# EAGLE board radio_module (EAGLE 6.6.0)
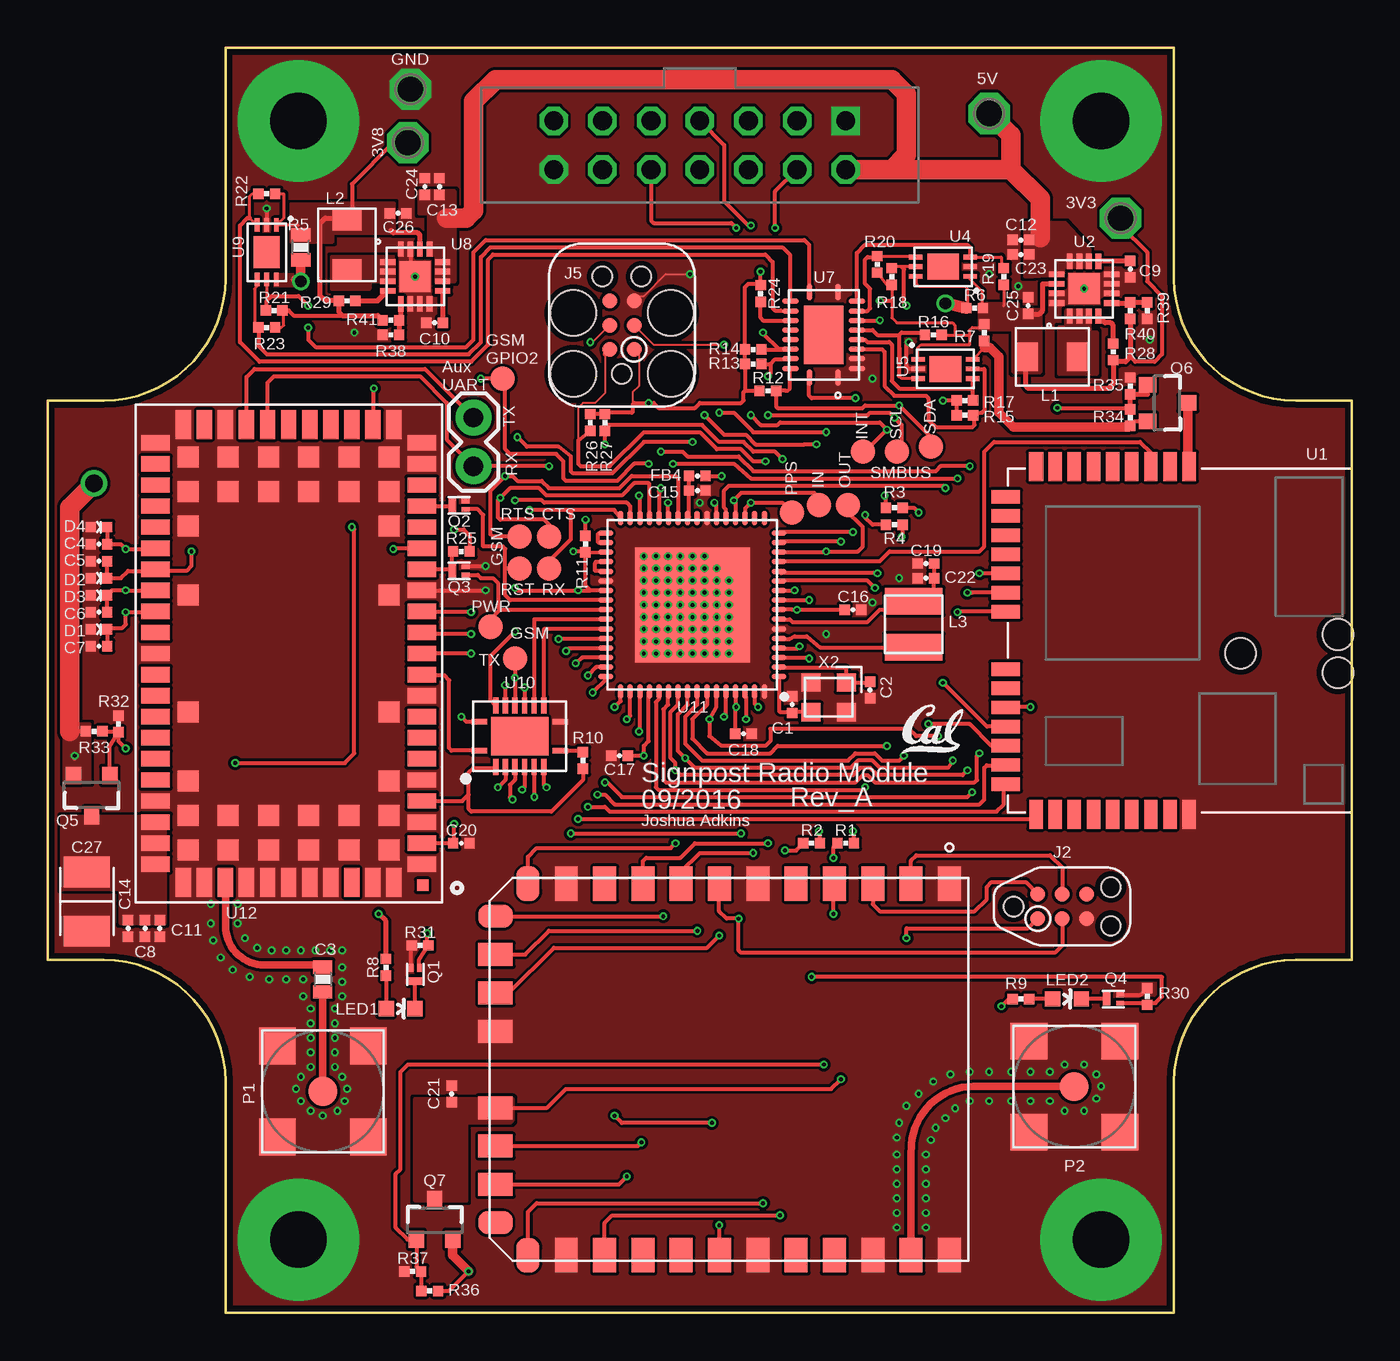
[diagram p5: board, top side]
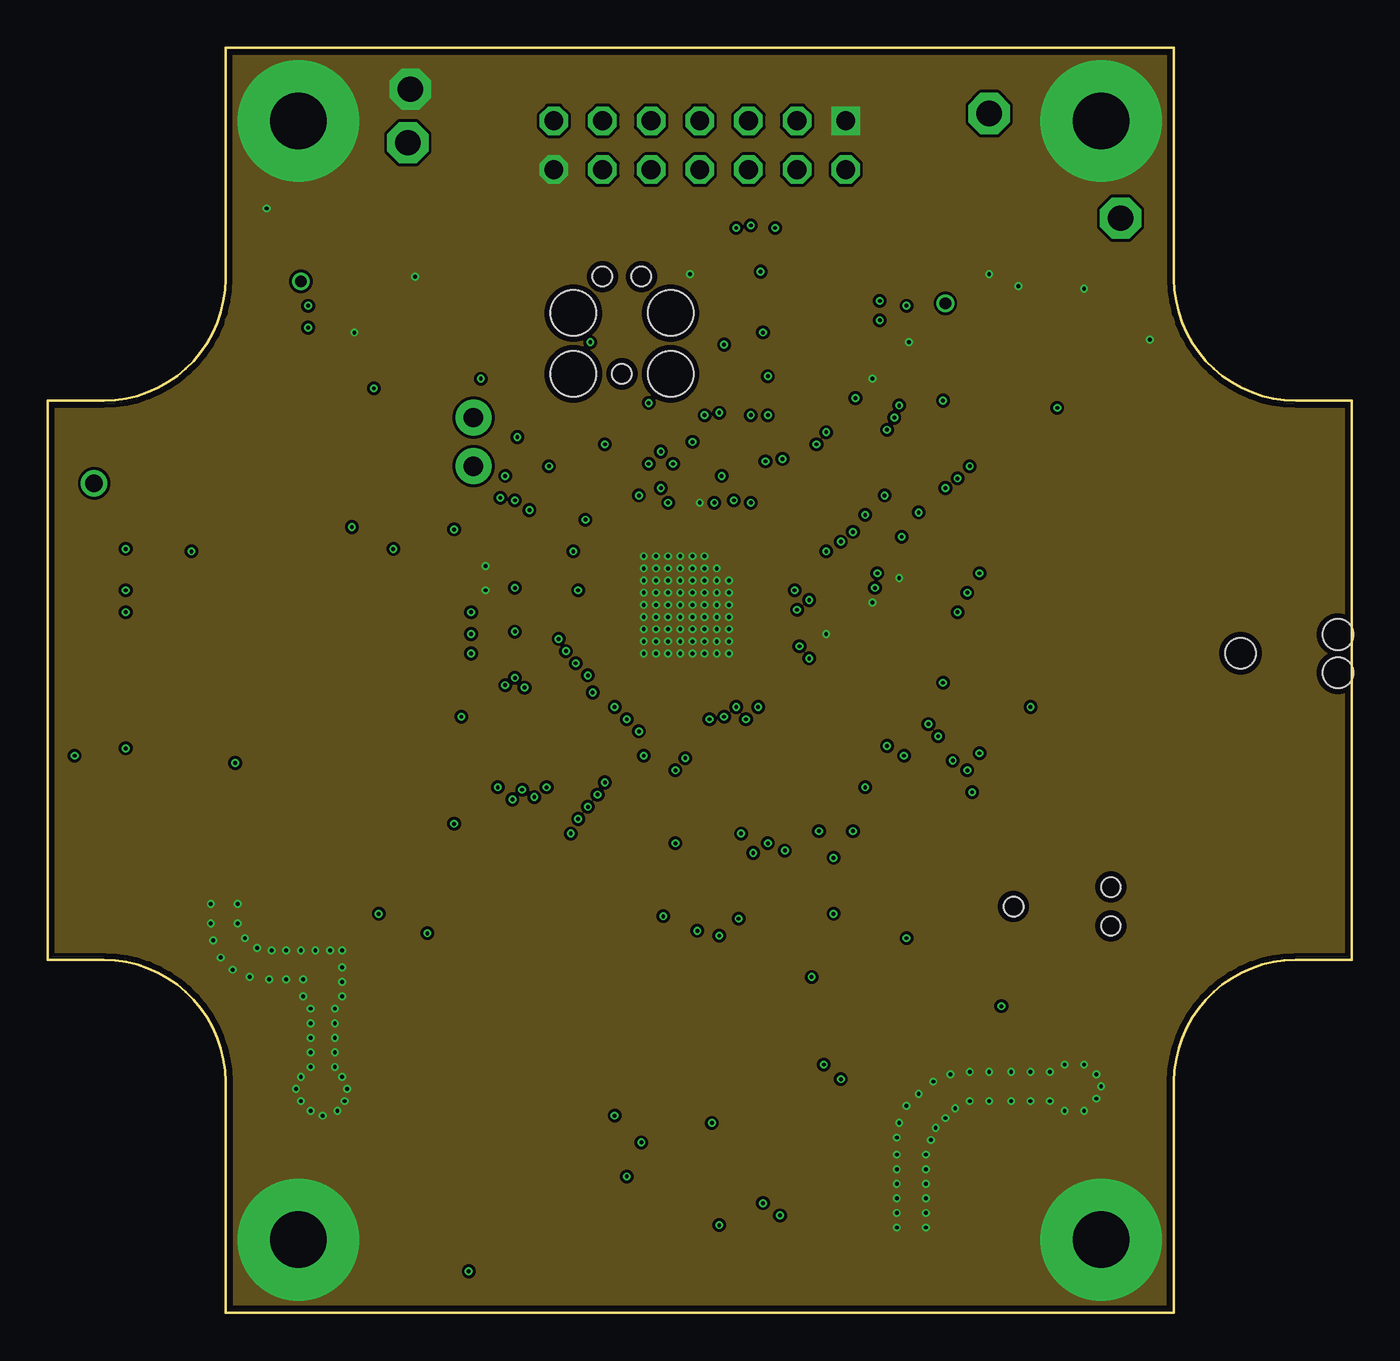
[diagram p6: board, inner layer Route2]
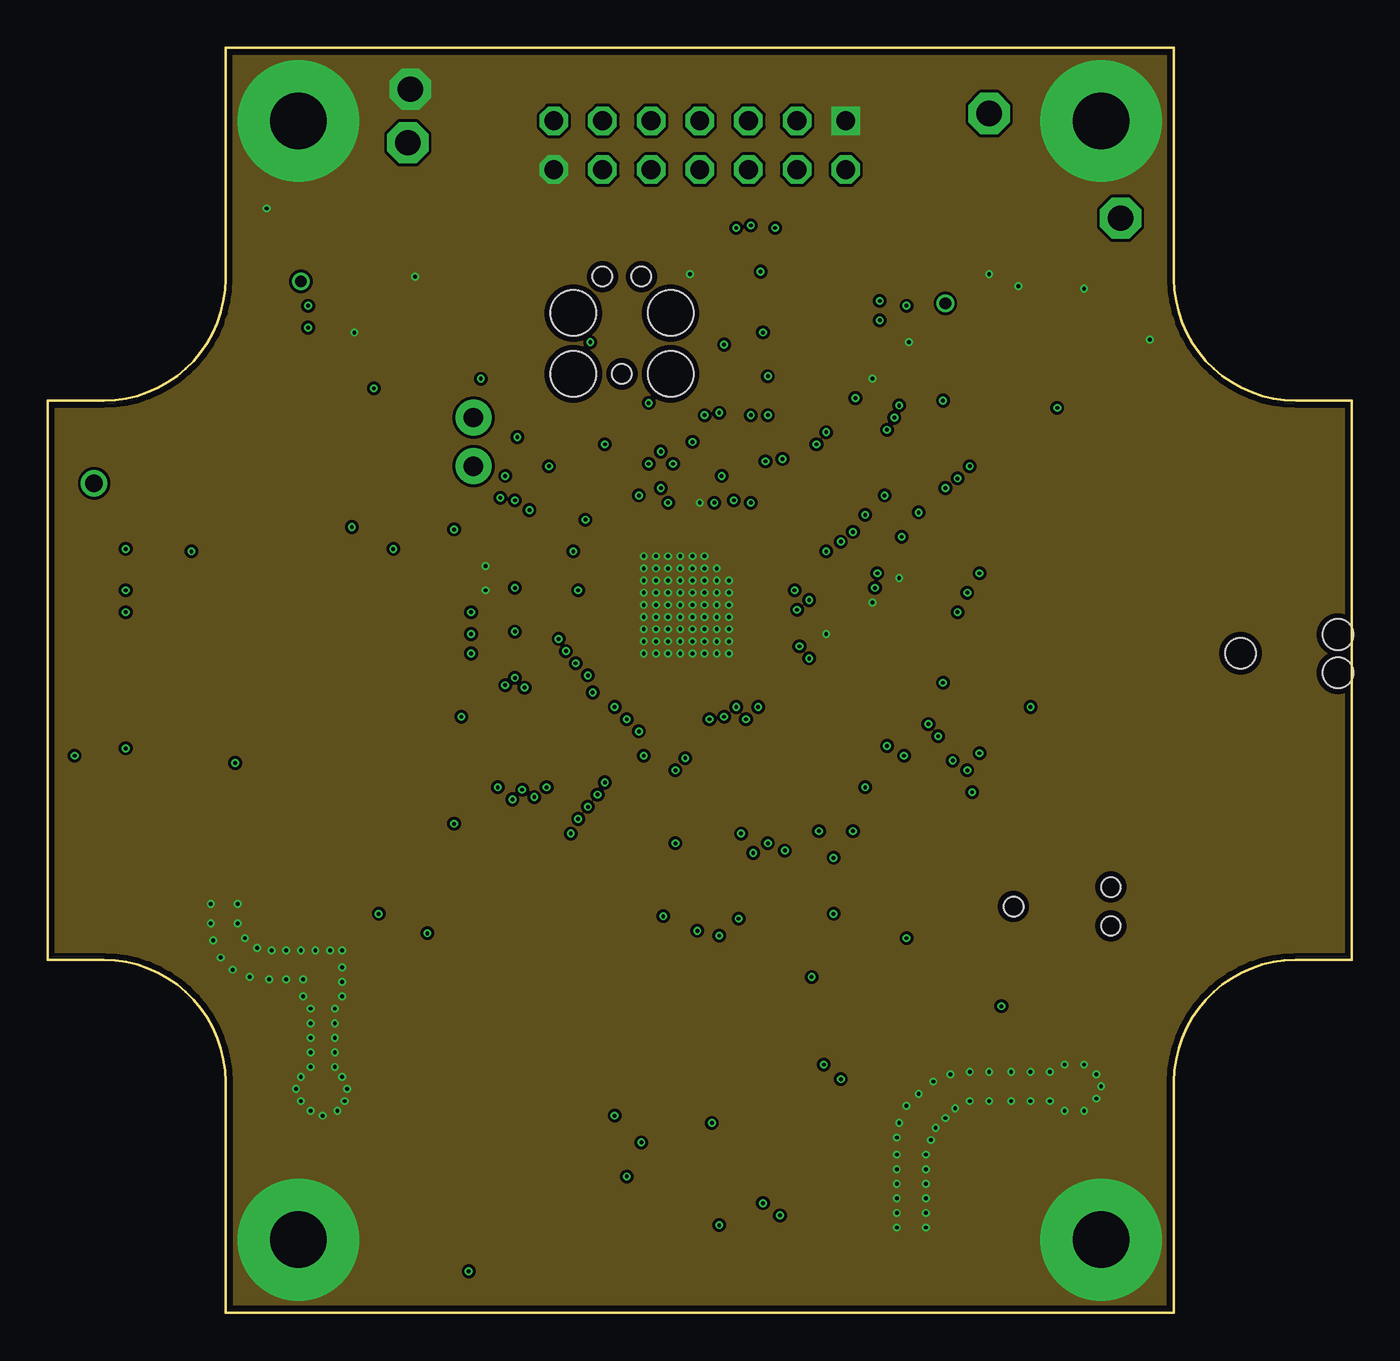
[diagram p7: board, inner layer Route15]
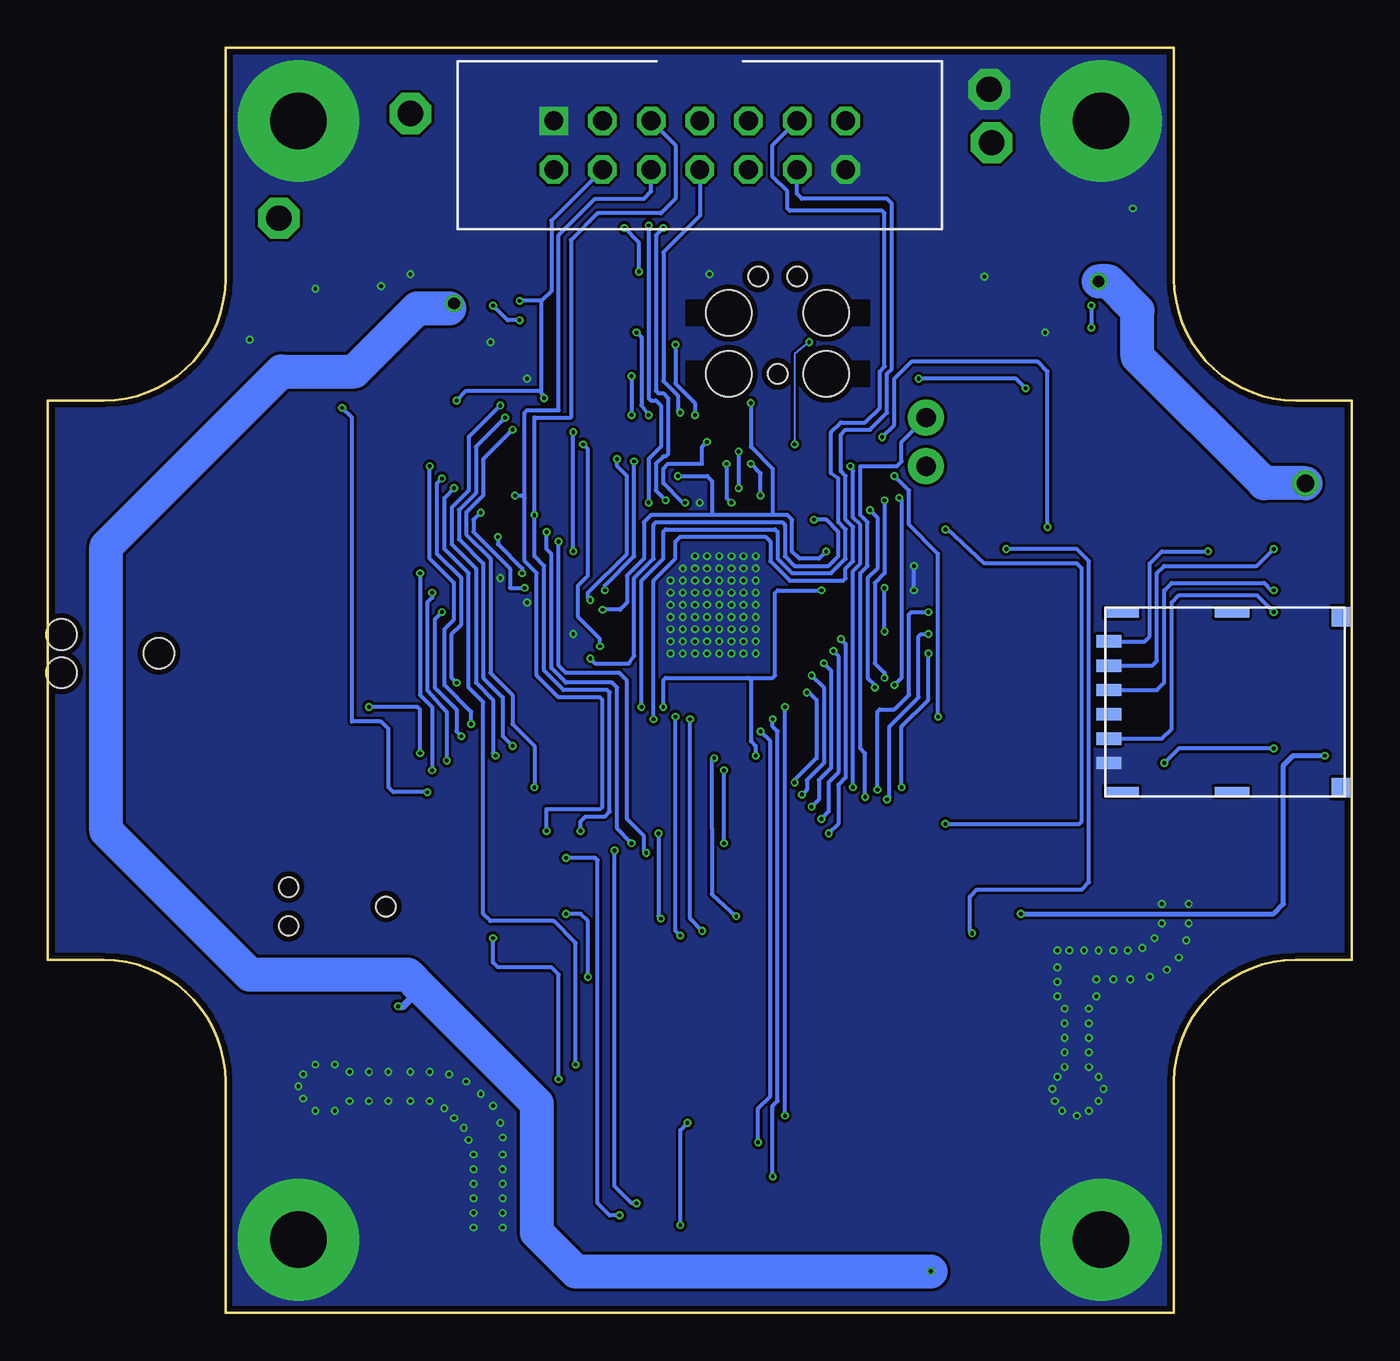
[diagram p8: board, bottom side, seen from below]

Size 68.07 x 66.04 mm. Coordinates in mm from the lower left corner, seen from the top.
Outline: 9.27,66.04 58.8,66.04 58.8,53.98 arc90 65.15,47.62 68.07,47.62 68.07,18.41 65.15,18.41 arc90 58.8,12.07 58.8,0 9.27,0 9.27,12.07 arc90 2.92,18.41 0,18.41 0,47.62 2.92,47.62 arc90 9.27,53.98 9.27,66.04
Copper layers ((1+2)*(15+16)): Top 0.0178mm / dielectric 59mil / Route2 0.0356mm / dielectric 0.1499mm / Route15 0.0356mm / dielectric 0.2007mm / Bottom 0.0178mm
Design rules "quickturn_co_kr_1oz *": minimum track width 4mil, minimum drill 0.200659375mm, track to track 6mil, track to pad 6mil, pad to pad 6mil, via to via 6mil, smd to smd 4mil, copper to edge 12mil, drill to drill 12mil, minimum pad ring 8mil, minimum via ring 4mil, stop-mask expansion 3mil, vias tented up to drill 50mil, thermal gap 10mil

## Footprints (pad centres in the part's own frame; a part is rotated, then mirrored left to right if it is on the bottom)
0402_CAP = smd 0.536 x 0.546: 1 -0.433,0; 2 0.433,0
0603_CAP = smd 0.7 x 1: 1 -0.65,0; 2 0.65,0
1210_CAP = smd 2.4 x 1.6: 1 0,1.55; 2 0,-1.55
0402_DIODE = smd 0.536 x 0.546: ANODE -0.433,0; CATHODE 0.433,0
MODULE_GENERIC = drill 0.991 square: 1 7.62,29.21 | drill 0.991 octagon: 2 7.62,26.67; 3 5.08,29.21; 4 5.08,26.67; 5 2.54,29.21; 6 2.54,26.67; 7 0,29.21; 8 0,26.67; 9 -2.54,29.21; 10 -2.54,26.67; 11 -5.08,29.21; 12 -5.08,26.67; 13 -7.62,29.21; 14 -7.62,26.67
TC2030-IDC-NL = smd 0.787 x 0.787: 1 -1.27,-0.635; 2 -1.27,0.635; 3 0,-0.635; 4 0,0.635; 5 1.27,-0.635; 6 1.27,0.635 | hole 1.016: -2.54,0; 2.54,1.016; 2.54,-1.016
WURTH_NANO_SIM = smd 0.65 x 1.3: C1 -1.905,6.07; C2 0.635,6.07; C3 1.905,6.07; C5 -3.175,6.07; C6 -0.635,6.07; C7 3.175,6.07 | smd 1.03 x 1: P$8 -4.465,-6.07; P$9 4.465,-6.07 | smd 0.48 x 1.8: P$10 -4.66,-0.35; P$11 4.66,-0.35; P$12 -4.66,5.4; P$13 4.66,5.4
TC2030-IDC = smd 0.787 x 0.787: 1 -1.27,-0.635; 2 -1.27,0.635; 3 0,-0.635; 4 0,0.635; 5 1.27,-0.635; 6 1.27,0.635 | hole 2.375: -2.54,2.54; 0.635,2.54; 0.635,-2.54; -2.54,-2.54 | hole 1.016: -2.54,0; 2.54,1.016; 2.54,-1.016
1X02 = drill 1.016 pad 1.88: 1 0,0; 2 2.54,0
IHL-1212BZ-11 = smd 1.2 x 1.5: P$1 -1.35,0; P$2 1.35,0
1212 = smd 1.4 x 3: P$1 -1.2,0; P$2 1.2,0
LED-0603 = smd 0.8 x 0.8: A 0,-0.75; C 0,0.75
SMA-J/PCB = smd 1.52 x 1.52: 1 0,0 | smd 1.91 x 1.91: 2 -2.375,-2.375; 3 2.375,-2.375; 4 2.375,2.375; 5 -2.375,2.375
XFDFN-3 = smd 0.4 x 0.7: D 0.35,0 | smd 0.4 x 0.25: G -0.35,0.215; S -0.35,-0.215
SOT23-3 = smd 0.8 x 0.9: 1 -0.95,-1; 2 0.95,-1; 3 0,1.1
0402_RES = smd 0.536 x 0.546: 1 -0.433,0; 2 0.433,0
0603-RES = smd 0.7 x 1: 1 -0.65,0; 2 0.65,0
B1,27 = smd 1.27 x 1.27: TP 0,0
P1-13 = drill 1.321 pad 2.159 octagon: TP 0,0
NUCLEUM = smd 0.7 x 1.5: 1 8.481,-0.109; 2 9.481,-0.109; 3 10.481,-0.109; 4 11.481,-0.109; 5 12.481,-0.109; 6 13.481,-0.109; 7 14.481,-0.109; 8 15.481,-0.109; 24 16.481,18.049; 25 15.481,18.049; 26 14.481,18.049; 27 13.481,18.049; 28 12.481,18.049; 29 11.481,18.049; 30 10.481,18.049; 31 9.481,18.049; 32 8.481,18.049 | smd 0.754 x 1.5: 9 16.481,-0.109 | smd 1.5 x 0.7: 10 18.06,1.47; 11 18.06,2.47; 12 18.06,3.47; 13 18.06,4.47; 14 18.06,5.47; 15 18.06,6.47; 16 18.06,7.47; 17 18.06,10.47; 18 18.06,11.47; 19 18.06,12.47; 20 18.06,13.47; 21 18.06,14.47; 22 18.06,15.47; 23 18.06,16.47 | hole 1.6: 0.72,8.66; 0.72,10.66; 5.8,9.64
TQFN-16/3MM = smd 0.3 x 0.8: 1 -0.75,-1.43; 2 -0.25,-1.43; 3 0.25,-1.43; 4 0.75,-1.43; 9 0.75,1.43; 10 0.25,1.43; 11 -0.25,1.43; 12 -0.75,1.43 | smd 0.8 x 0.3: 5 1.43,-0.75; 6 1.43,-0.25; 7 1.43,0.25; 8 1.43,0.75; 13 -1.43,0.75; 14 -1.43,0.25; 15 -1.43,-0.25; 16 -1.43,-0.75 | smd 1.63 x 1.63: GND 0,0
DFN-6-2MMX3MM = smd 0.25 x 0.7: 1 -0.5,-1.425; 2 0,-1.425; 3 0.5,-1.425; 4 0.5,1.425; 5 0,1.425; 6 -0.5,1.425 | smd 1.35 x 1.65: NC 0,0
IM880_MODULE = smd 1.8 x 1.2: 1 -9.7,11; 2 -9.7,9; 3 -9.7,7; 4 -9.7,5; 5 -9.7,3; 6 -9.7,1; 7 -9.7,-1; 8 -9.7,-3; 9 -9.7,-5; 10 -9.7,-7; 11 -9.7,-9; 12 -9.7,-11; 21 9.7,-11; 22 9.7,-9; 23 9.7,-7; 24 9.7,-5; 25 9.7,-3; 26 9.7,-1; 27 9.7,1; 28 9.7,3; 29 9.7,5; 30 9.7,7; 31 9.7,9; 32 9.7,11 | smd 1.2 x 1.8: 13 -8,-12.7; 14 -6,-12.7; 15 -4,-12.7; 16 -2,-12.7; 17 2,-12.7; 18 4,-12.7; 19 6,-12.7; 20 8,-12.7
QFN-N20 = smd 0.85 x 0.28: 1 -2.23,-0.75; 10 2.23,-0.75; 11 2.23,0.75; 20 -2.23,0.75 | smd 0.28 x 0.85: 2 -1.75,-1.73; 3 -1.25,-1.73; 4 -0.75,-1.73; 5 -0.25,-1.73; 6 0.25,-1.73; 7 0.75,-1.73; 8 1.25,-1.73; 9 1.75,-1.73; 12 1.75,1.73; 13 1.25,1.73; 14 0.75,1.73; 15 0.25,1.73; 16 -0.25,1.73; 17 -0.75,1.73; 18 -1.25,1.73; 19 -1.75,1.73 | smd 3.05 x 2.05: P$22 0,0
R-PVQFN-N16 = smd 0.825 x 0.28: 1 -2.112,-0.75; 8 2.112,-0.75; 9 2.112,0.75; 16 -2.112,0.75 | smd 0.28 x 0.825: 2 -1.25,-1.613; 3 -0.75,-1.613; 4 -0.25,-1.613; 5 0.25,-1.613; 6 0.75,-1.613; 7 1.25,-1.613; 10 1.25,1.613; 11 0.75,1.613; 12 0.25,1.613; 13 -0.25,1.613; 14 -0.75,1.613; 15 -1.25,1.613 | smd 3 x 2: THERMAL 0,0
QFN-64-9MM = smd 0.75 x 0.28: 1 -4.525,3.75; 2 -4.525,3.25; 3 -4.525,2.75; 4 -4.525,2.25; 5 -4.525,1.75; 6 -4.525,1.25; 7 -4.525,0.75; 8 -4.525,0.25; 9 -4.525,-0.25; 10 -4.525,-0.75; 11 -4.525,-1.25; 12 -4.525,-1.75; 13 -4.525,-2.25; 14 -4.525,-2.75; 15 -4.525,-3.25; 16 -4.525,-3.75; 33 4.525,-3.75; 34 4.525,-3.25; 35 4.525,-2.75; 36 4.525,-2.25; 37 4.525,-1.75; 38 4.525,-1.25; 39 4.525,-0.75; 40 4.525,-0.25; 41 4.525,0.25; 42 4.525,0.75; 43 4.525,1.25; 44 4.525,1.75; 45 4.525,2.25; 46 4.525,2.75; 47 4.525,3.25; 48 4.525,3.75 | smd 0.28 x 0.75: 17 -3.75,-4.525; 18 -3.25,-4.525; 19 -2.75,-4.525; 20 -2.25,-4.525; 21 -1.75,-4.525; 22 -1.25,-4.525; 23 -0.75,-4.525; 24 -0.25,-4.525; 25 0.25,-4.525; 26 0.75,-4.525; 27 1.25,-4.525; 28 1.75,-4.525; 29 2.25,-4.525; 30 2.75,-4.525; 31 3.25,-4.525; 32 3.75,-4.525; 49 3.75,4.525; 50 3.25,4.525; 51 2.75,4.525; 52 2.25,4.525; 53 1.75,4.525; 54 1.25,4.525; 55 0.75,4.525; 56 0.25,4.525; 57 -0.25,4.525; 58 -0.75,4.525; 59 -1.25,4.525; 60 -1.75,4.525; 61 -2.25,4.525; 62 -2.75,4.525; 63 -3.25,4.525; 64 -3.75,4.525 | smd 6 x 6: GND 0,0
UBLOX_SARA_G3 = smd 0.6 x 0.6: 1IND -12.1,-7 | smd 1.1 x 1.1: P65 -10.25,-5.25; P66 -10.25,-3.15; P67 -10.25,-1.05; P68 -10.25,1.05; P69 -10.25,3.15; P70 -10.25,5.25; P71 -8.45,-5.25; P72 -8.45,-3.15; P73 -8.45,-1.05; P74 -8.45,1.05; P75 -8.45,3.15; P76 -8.45,5.25; P77 -6.65,-5.25; P78 -6.65,5.25; P79 -3.05,-5.25; P80 -3.05,5.25; P81 3.05,-5.25; P82 3.05,5.25; P83 6.65,-5.25; P84 6.65,5.25; P85 8.45,-5.25; P86 8.45,-3.15; P87 8.45,-1.05; P88 8.45,1.05; P89 8.45,3.15; P90 8.45,5.25; P91 10.25,-5.25; P92 10.25,-3.15; P93 10.25,-1.05; P94 10.25,1.05; P95 10.25,3.15; P96 10.25,5.25 | smd 0.8 x 1.5: P$1 -11,-6.95; P$2 -9.9,-6.95; P$3 -8.8,-6.95; P$4 -7.7,-6.95; P$5 -6.6,-6.95; P$6 -5.5,-6.95; P$7 -4.4,-6.95; P$8 -3.3,-6.95; P$9 -2.2,-6.95; P$10 -1.1,-6.95; P$11 0,-6.95; P$12 1.1,-6.95; P$13 2.2,-6.95; P$14 3.3,-6.95; P$15 4.4,-6.95; P$16 5.5,-6.95; P$17 6.6,-6.95; P$18 7.7,-6.95; P$19 8.8,-6.95; P$20 9.9,-6.95; P$21 11,-6.95; P$33 11,6.95; P$34 9.9,6.95; P$35 8.8,6.95; P$36 7.7,6.95; P$37 6.6,6.95; P$38 5.5,6.95; P$39 4.4,6.95; P$40 3.3,6.95; P$41 2.2,6.95; P$42 1.1,6.95; P$43 0,6.95; P$44 -1.1,6.95; P$45 -2.2,6.95; P$46 -3.3,6.95; P$47 -4.4,6.95; P$48 -5.5,6.95; P$49 -6.6,6.95; P$50 -7.7,6.95; P$51 -8.8,6.95; P$52 -9.9,6.95; P$53 -11,6.95 | smd 1.5 x 0.8: P$22 11.95,-5.5; P$23 11.95,-4.4; P$24 11.95,-3.3; P$25 11.95,-2.2; P$26 11.95,-1.1; P$27 11.95,0; P$28 11.95,1.1; P$29 11.95,2.2; P$30 11.95,3.3; P$31 11.95,4.4; P$32 11.95,5.5; P$54 -11.95,5.5; P$55 -11.95,4.4; P$56 -11.95,3.3; P$57 -11.95,2.2; P$58 -11.95,1.1; P$59 -11.95,0; P$60 -11.95,-1.1; P$61 -11.95,-2.2; P$62 -11.95,-3.3; P$63 -11.95,-4.4; P$64 -11.95,-5.5
FHXXX = smd 1 x 0.95: 1 -0.925,-0.775; 2 0.925,-0.775; 3 0.925,0.775; 4 -0.925,0.775

## Placement (x,y rotation side)
C1  8pF  [0402_CAP]  38.86,31.75 90 top
C2  8pF  [0402_CAP]  42.93,32.51 270 top
C3  33pF  [0603_CAP]  14.35,17.4 270 top
C4  47pF  [0402_CAP]  2.67,40.13 180 top
C5  47pF  [0402_CAP]  2.67,39.24 180 top
C6  47pF  [0402_CAP]  2.67,36.58 180 top
C7  47pF  [0402_CAP]  2.67,34.8 180 top
C8  56pF  [0402_CAP]  5.08,20.07 270 top
C9  3.3nF  [0402_CAP]  56.52,54.48 90 top
C10  3.3nF  [0402_CAP]  20.19,51.69 0 top
C11  10nF  [0402_CAP]  5.84,20.07 270 top
C12  0.1uF  [0402_CAP]  50.8,56.01 180 top
C13  0.1uF  [0402_CAP]  20.45,58.8 90 top
C14  100nF  [0402_CAP]  4.19,20.07 270 top
C15  100nF  [0402_CAP]  33.91,42.93 0 top
C16  100nF  [0402_CAP]  42.04,36.7 0 top
C17  100nF  [0402_CAP]  29.85,29.08 180 top
C18  100nF  [0402_CAP]  36.32,30.23 0 top
C19  100nF  [0402_CAP]  45.85,39.12 180 top
C20  100nF  [0402_CAP]  21.59,24.51 0 top
C21  1uF  [0402_CAP]  21.08,11.43 90 top
C22  4.7uF  [0402_CAP]  45.85,38.35 180 top
C23  10uF  [0402_CAP]  50.8,55.24 180 top
C24  10uF  [0402_CAP]  19.68,58.8 90 top
C25  22uF  [0402_CAP]  51.18,52.58 270 top
C26  22uF  [0402_CAP]  18.29,57.4 180 top
C27  220uF  [1210_CAP]  2.03,21.46 0 top
D1  14V  [0402_DIODE]  2.67,35.69 0 top
D2  [0402_DIODE]  2.67,38.35 0 top
D3  [0402_DIODE]  2.67,37.47 0 top
D4  [0402_DIODE]  2.67,41.02 0 top
FB4  1.5k  [0402_CAP]  33.91,43.69 0 top
J1  MODULE_GENERIC  [MODULE_GENERIC]  34.04,33.02 0 top
J2  TC2030-JLINK-NL  [TC2030-IDC-NL]  52.96,21.21 0 top
J4  NANO_SIM  [WURTH_NANO_SIM]  6.6,31.88 90 bottom
J5  TC2030-JLINK-L  [TC2030-IDC]  29.97,51.56 90 top
JP1  [1X02]  22.22,44.2 90 top
L1  2.2uH  [IHL-1212BZ-11]  52.45,49.91 180 top
L2  2.2uH  [IHL-1212BZ-11]  15.62,55.75 90 top
L3  22uH  [1212]  45.21,35.94 270 top
LED1  LED0603  [LED-0603]  18.41,15.88 270 top
LED2  LED0603  [LED-0603]  53.21,16.38 270 top
P1  MOLEX_73251-135X  [SMA-J/PCB]  14.35,11.56 0 top
P2  MOLEX_73251-135X  [SMA-J/PCB]  53.59,11.81 180 top
Q1  MOSFET-NCHANNELXFDN-3  [XFDFN-3]  19.18,17.65 270 top
Q2  MOSFET-NCHANNELXFDN-3  [XFDFN-3]  21.46,42.16 180 top
Q3  MOSFET-NCHANNELXFDN-3  [XFDFN-3]  21.46,38.73 180 top
Q4  MOSFET-NCHANNELXFDN-3  [XFDFN-3]  55.63,16.38 180 top
Q5  SI223DDS  [SOT23-3]  2.29,27.05 180 top
Q6  SI223DDS  [SOT23-3]  58.42,47.5 270 top
Q7  SI223DDS  [SOT23-3]  20.19,4.83 0 top
R1  0  [0402_RES]  41.66,24.51 0 top
R2  0  [0402_RES]  39.88,24.51 0 top
R3  0  [0402_RES]  44.2,42.04 180 top
R4  0  [0402_RES]  44.2,41.15 180 top
R5  0.015  [0603-RES]  13.21,55.63 90 top
R6  0.43  [0402_RES]  48.39,52.45 0 top
R7  3.32  [0402_RES]  48.9,51.18 90 top
R8  1k  [0402_RES]  17.65,18.03 90 top
R9  1k  [0402_RES]  50.8,16.38 180 top
R10  10k  [0402_RES]  27.94,28.83 270 top
R11  10k  [0402_RES]  28.07,40.13 270 top
R12  10k  [0402_RES]  37.59,48.13 0 top
R13  10k  [0402_RES]  36.83,49.53 0 top
R14  10k  [0402_RES]  36.83,50.29 0 top
R15  10k  [0402_RES]  47.88,46.86 180 top
R16  10k  [0402_RES]  46.23,51.05 0 top
R17  10k  [0402_RES]  47.88,47.62 180 top
R18  10k  [0402_RES]  44.07,54.1 270 top
R19  10k  [0402_RES]  49.91,54.1 270 top
R20  10k  [0402_RES]  43.31,54.74 270 top
R21  10k  [0402_RES]  11.81,52.32 0 top
R22  10k  [0402_RES]  11.43,58.42 0 top
R23  10k  [0402_RES]  11.43,51.44 0 top
R24  10k  [0402_RES]  37.21,53.21 270 top
R25  100k  [0402_RES]  21.59,39.75 0 top
R26  100k  [0402_RES]  28.32,46.48 90 top
R27  100k  [0402_RES]  29.08,46.48 90 top
R28  100k  [0402_RES]  55.63,50.16 270 top
R29  100k  [0402_RES]  15.62,52.83 180 top
R30  100k  [0402_RES]  57.4,16.51 270 top
R31  100k  [0402_RES]  19.43,19.18 0 top
R32  100k  [0402_RES]  3.68,30.73 270 top
R33  100k  [0402_RES]  2.41,30.35 180 top
R34  100k  [0402_RES]  56.52,46.74 270 top
R35  100k  [0402_RES]  56.52,48.39 270 top
R36  100k  [0402_RES]  19.94,1.14 0 top
R37  100k  [0402_RES]  19.05,2.16 0 top
R38  200k  [0402_RES]  17.91,51.05 0 top
R39  240k  [0402_RES]  57.4,52.32 90 top
R40  750k  [0402_RES]  56.52,52.32 270 top
R41  750k  [0402_RES]  17.91,51.82 180 top
TP1  TPB1,27  [B1,27]  41.78,42.16 0 top
TP2  TPB1,27  [B1,27]  38.86,41.78 0 top
TP3  TPB1,27  [B1,27]  40.26,42.16 0 top
TP4  TPB1,27  [B1,27]  46.1,45.21 0 top
TP5  TPB1,27  [B1,27]  44.32,44.96 0 top
TP6  TPB1,27  [B1,27]  23.11,35.81 0 top
TP7  TPB1,27  [B1,27]  24.64,38.86 0 top
TP8  TPB1,27  [B1,27]  26.16,38.86 0 top
TP9  TPB1,27  [B1,27]  24.38,34.16 0 top
TP10  TPB1,27  [B1,27]  23.75,48.77 0 top
TP11  TPB1,27  [B1,27]  26.16,40.51 0 top
TP12  TPB1,27  [B1,27]  24.64,40.51 0 top
TP13  TPB1,27  [B1,27]  42.55,44.96 0 top
TP14  PTR1PAD1-13  [P1-13]  18.8,61.09 0 top
TP15  PTR1PAD1-13  [P1-13]  18.92,63.88 0 top
TP16  PTR1PAD1-13  [P1-13]  49.15,62.61 0 top
TP17  PTR1PAD1-13  [P1-13]  56.01,57.15 0 top
U1  NUCLEUM  [NUCLEUM]  68.07,44.07 180 top
U2  TLV62130  [TQFN-16/3MM]  54.1,53.47 0 top
U4  LTC2941  [DFN-6-2MMX3MM]  46.74,54.61 90 top
U5  LTC2941  [DFN-6-2MMX3MM]  46.86,49.28 270 top
U6  IM880_MODULE  [IM880_MODULE]  36.07,12.7 270 top
U7  PCA9544AQFN-N20  [QFN-N20]  40.51,51.05 90 top
U8  TLV62130  [TQFN-16/3MM]  19.18,54.1 270 top
U9  LTC2941  [DFN-6-2MMX3MM]  11.43,55.37 180 top
U10  TXB0106  [R-PVQFN-N16]  24.64,30.1 0 top
U11  SAM4LC8BA  [QFN-64-9MM]  33.66,36.96 180 top
U12  UBLOX_SARA_G350  [UBLOX_SARA_G3]  12.57,34.42 90 top
U$1  UCB_CAL100MIL  [UCB_CAL_100MIL]  44.58,29.21 0 top
X2  16 MHz  [FHXXX]  40.77,32.13 180 top

## Tracks (layer width: path | path; a pad name or v marks a point on that pad's centre or on a via)
3V3  (via drill 0.2)
  Top 0.102: J5.1 30.86,50.04 30.86,48.39 30.53,48.06 30.53,47.42
  Top 0.152: R7.2 48.72,51.44 48.26,51.44 48.13,51.31 48.13,51.05 | U4.1 48.16,53.95 48.77,53.34 48.77,52.45 R6.2 | R16.2 47.37,51.05 | 47.37,51.05 48.13,51.05 | U5.1 45.44,50.39 45.59,50.55 48.13,50.55 48.13,51.05 | R19.2 49.91,52.58 | R20.2 43.82,53.67 R18.2 44.07,52.83 44.07,51.94 44.32,51.69 47.24,51.69 47.37,51.56 47.37,51.05
  Top 0.203: R17.2 R15.2 | R17.2 47.37,47.68 | U11.35 29.1,39.68 R11.2 | U11.39 28.32,37.72 | 28.32,37.72 28.07,37.97 R11.2 | v43.43,52.83 44.07,52.83 | 39.75,48.9 U7.20 39.75,48.56 39.75,47.88 39.88,47.75 v42.16,47.75 | 36.4,48.13 R13.1 R14.1 36.4,53.54 36.58,53.72 37.14,53.72 R24.1 v37.21,54.36 | 36.4,48.13 R12.1 | U11.52 31.37,32.4 31.37,29.84 31.11,29.59 v31.11,29.08 C17.1 | U11.61 35.91,31.79 v35.94,31.62 35.89,31.7 C18.1 | 28.32,37.72 v27.69,37.72 24.51,37.72 v24.38,37.85 | U11.8 38.87,36.71 38.87,36.7 v39.12,36.7 C16.1 | R17.2 v46.74,47.62 | U10.15 23.11,31.99 23.11,34.29 v24.38,35.56 | FB4.2 v35.18,43.69 | R11.2 28.02,39.75 v27.43,39.75 | R26.2 R27.2 29.13,46.99 30.48,46.99 30.53,47.04 30.53,47.42 30.61,47.5 v31.37,47.5 31.62,47.5 31.88,47.24 33.78,47.24 34.04,47.5 36.2,47.5 36.32,47.62 36.32,48.06 36.4,48.13 | v37.97,56.64 37.97,58.55 J1.4 | TP17.TP 56.01,56.77 57.4,55.37 57.4,53.85 58.17,53.09 58.17,50.04 57.79,49.66 56.77,49.66 56.52,49.91
  Top 0.254: C25.2 51.76,52.15 51.94,52.32 51.94,53.72 U2.14 | L1.P$2 51.05,49.86 51.05,48.39 51.18,48.26 55.37,48.26 55.63,48.51 R28.2 55.7,49.66 56.26,49.66 56.52,49.91 R40.2
  Bottom 0.203: J1.4 41.78,57.02 41.78,53.34 42.29,52.83 | 42.29,52.83 v43.43,52.83 | v42.16,47.75 42.29,48.01 | 42.29,48.01 42.29,52.83 | v35.94,31.62 35.94,33.02 35.81,33.15 31.5,33.15 | 31.5,33.15 31.37,33.02 31.37,29.84 31.11,29.59 v31.11,29.08 | 31.5,33.15 30.23,33.15 30.1,33.27 30.1,37.59 29.97,37.72 v27.69,37.72 | v46.74,47.62 46.23,48.13 42.42,48.13 42.29,48.01 | v24.38,35.56 v24.38,37.85 | v27.43,39.75 27.81,39.37 28.83,39.37 29.21,39.75 29.21,41.4 29.46,41.66 30.23,41.66 | 30.23,41.66 33.4,41.66 | 33.4,41.66 36.58,41.66 36.96,41.27 36.96,39.37 37.85,38.48 37.85,37.08 38.18,36.75 U11.8 v39.12,36.7 | v35.18,43.69 33.66,43.69 33.4,43.43 33.4,41.66 | v31.37,47.5 31.37,45.21 30.23,44.07 30.23,41.66 | v37.21,54.36 37.21,55.88 v37.97,56.64
  pour Top (no thermals): 51.82,49.15 51.82,52.32 50.42,52.32 50.42,49.15
  pour Top (no thermals): 50.67,51.31 48.64,51.31 48.64,52.7 50.67,52.7
3V8
  Top 0.152: 13.08,56.77 13.05,56.8 U9.1 11.99,56.86 12.32,57.15 12.32,58.42 R22.2 | R23.2 12.19,51.44 12.32,51.56 12.32,52.15 R21.2
  Top 0.203: R21.2 12.57,52.32 12.83,52.07 15.37,52.07 | TP14.TP 18.03,61.09 15.88,58.93 15.88,57.36 L2.P$2
  Top 0.254: L2.P$2 15.57,57.15 14.48,57.15 14.22,56.9 14.22,53.09 14.48,52.83 R29.2 15.19,52.25 15.37,52.07 17.22,52.07 R41.2 | U8.14 19.43,56.27 19.3,56.39 18.03,56.39 17.91,56.52
  pour Top (no thermals): 14.86,57.91 18.03,57.91 18.03,56.39 14.86,56.39
  pour Top (no thermals): 12.7,55.88 12.7,57.91 14.86,57.91 14.86,55.88
3V8SWOUT
  pour Top (no thermals): 14.86,55.12 18.03,55.12 18.03,53.85 16.76,53.85 16.76,53.47 14.86,53.47
3VSWOUT
  pour Top (no thermals): 52.83,49.02 52.83,51.44 53.21,51.44 53.21,52.32 54.36,52.32 54.36,51.18 54.74,51.18 54.74,49.02
5V
  Top 0.254: U2.10
  Top 1.016: 50.29,59.69 J1.2 44.07,59.69 44.83,60.45 44.83,63.63 44.07,64.39 23.37,64.39 22.22,63.25 22.22,57.53 21.84,57.15 20.83,57.15 | 50.29,59.69 51.82,58.17 51.82,56.13 | 50.29,59.69 50.29,61.47 TP16.TP
  pour Top (no thermals): 54.36,54.61 52.96,54.61 52.96,54.23 51.05,54.1 51.05,56.9 53.09,56.9 54.36,55.5
  pour Top (no thermals): 19.94,55.24 19.94,57.4 19.43,57.4 19.43,58.55 21.21,58.55 21.21,53.85 20.32,53.85 20.32,55.24
!CONTROLLER_RESET  (via drill 0.2)
  Top 0.102: J5.3 31.62,50.55 v35.31,50.55
  Top 0.203: U11.4 38.22,34.67 39.12,34.67 v39.24,34.8 | v34.29,46.86 35.31,45.85 36.45,45.85 36.96,45.34 39.5,45.34 v40.13,45.34
  Bottom 0.203: v35.31,50.55 35.31,48.51 34.29,47.5 v34.29,46.86 | v39.24,34.8 39.24,35.18 40.39,36.32 40.39,37.97 39.88,38.48 39.88,45.09 v40.13,45.34
!GSM_RST
  Top 0.203: U11.40 24.13,37.21 23.88,37.47 23.88,38.86 | 23.88,38.86 23.88,39.88 23.75,40.01 22.73,40.01 22.73,41.66 22.44,41.95 Q2.G | TP7.TP 23.88,38.86
!IM880_RESET  (via drill 0.2)
  Top 0.203: U11.44 28.93,35.21 29.08,35.18 v26.67,35.18 | v27.3,25.02 v36.2,25.02 | 35.05,22.42 U6.7 35.05,22.38 35.05,20.96 35.43,20.57 v36.07,20.57 36.07,18.92 36.2,18.8 52.58,18.8 52.96,19.18 J2.3
  Bottom 0.203: v26.67,35.18 26.42,34.93 26.42,27.94 26.8,27.56 26.8,25.53 v27.3,25.02 | v36.2,25.02 36.2,20.7 v36.07,20.57
!NUCLEUM_RESET
  Top 0.203: U11.13 38.22,39.24 43.43,39.24 43.94,39.75 48.64,39.75 48.9,40.01 48.9,44.96 49.4,45.47 57.02,45.47 57.59,44.9 U1.3
CONTROLLER_BUCK/LDO_N  (via drill 0.2)
  Top 0.203: R11.1 v28.07,41.4 | U11.3 39.8,34.21 v39.75,34.16
  Bottom 0.203: v39.75,34.16 39.5,33.91 37.72,33.91 37.47,34.29 37.47,38.35 36.83,38.99 36.45,39.37 36.45,41.15 36.32,41.27 29.72,41.27 29.59,41.15 29.59,39.5 29.08,38.99 27.3,38.99 26.8,39.5 26.8,40.77 27.43,41.4 v28.07,41.4
CONTROLLER_SWDCLK  (via drill 0.2)
  Top 0.102: J5.4 28.45,50.67 v28.32,50.67
  Top 0.203: U11.9 v39.75,37.21 | v29.08,45.34 R27.1 29.26,46.36 34.16,46.36 35.05,45.47 36.32,45.47 36.83,44.96 37.97,44.96 v38.35,44.58
  Bottom 0.102: v28.32,50.67 29.08,50.04 v29.08,45.34
  Bottom 0.203: v39.75,37.21 39.88,37.34 39.88,37.59 37.85,39.62 37.85,43.69 38.35,44.2 v38.35,44.58
CONTROLLER_SWDIO  (via drill 0.2)
  Top 0.102: 29.08,50.04 29.08,48.01 28.57,47.5 27.94,47.5 27.69,47.24 27.69,45.54
  Top 0.203: U11.10 38.19,37.72 v38.99,37.72 | J5.2 29.08,50.04 | v37.47,44.45 36.83,44.45 36.2,45.09 34.93,45.09 34.04,45.97 31.11,45.97 29.34,44.2 27.81,44.2 27.69,44.32 27.69,45.54 R26.1
  Bottom 0.203: v38.99,37.72 38.99,37.97 37.47,39.5 v37.47,44.45
CONTROLLER_XIN
  Top 0.203: X2.3 38.77,31.36 C1.1 38.81,31.37 38.23,31.37 38.18,31.42 U11.1
CONTROLLER_XOUT
  Top 0.203: C2.1 42.89,32.91 X2.1 41.69,33.62 41.66,33.66 38.23,33.66 U11.2
GND  (via drill 0.2, 2.95 pad 6.35)
  Top 0.102: J5.5 30.86,53.09 31.11,53.09 32.26,54.23 v33.53,54.23
  Top 0.203: Q4.S 57.06,16.6 R30.1 | Q1.S 18.96,19.21 R31.1 | U8.15 18.93,54.35 U8.GND | v11.43,57.66 U9.2 | U5.2 44.96,49.28 44.83,49.4 44.83,50.55 v44.96,50.67 | U12.P$14 v22.86,37.72 | v22.86,38.99 22.82,38.95 Q3.S
  Top 0.254: 53.85,53.22 U2.GND 54.35,53.22
  Bottom 0.203: v22.86,37.72 v22.86,38.99
  other vias: 19.18,54.1 49.15,54.23 16,51.18 43.05,48.77 34.04,42.29 40.64,35.43 43.05,37.08 50.67,53.59 54.1,53.47 13.08,3.81 54.99,3.81 54.99,62.23 13.08,62.23 44.32,4.45 44.32,5.21 44.32,5.97 44.32,6.73 44.32,7.49 44.32,8.25 44.32,9.14 44.45,9.91 44.83,10.8 45.47,11.43 46.23,12.07 47.12,12.45 48.13,12.57 49.15,12.57 50.29,12.57 51.31,12.57 45.85,4.45 45.85,5.21 45.85,5.97 45.85,6.73 45.85,7.49 45.85,8.25 46.1,9.02 46.36,9.65 46.86,10.16 47.37,10.67 48.13,11.05 49.15,11.05 50.29,11.05 51.31,11.05 52.32,11.05 53.09,10.54 54.1,10.54 54.74,11.18 54.99,11.81 54.74,12.45 54.1,12.95 53.09,12.95 52.32,12.57 8.51,21.34 8.51,20.32 8.64,19.43 9.02,18.54 9.65,17.91 10.54,17.53 11.56,17.4 12.45,17.4 13.34,17.4 13.34,16.51 13.72,15.88 13.72,15.11 13.72,14.35 13.72,13.59 13.72,12.83 13.21,12.32 12.95,11.68 13.21,11.05 13.72,10.54 14.35,10.29 15.11,10.54 15.49,11.05 15.62,11.68 15.37,12.32 14.99,12.83 14.99,13.59 14.99,14.35 14.99,15.11 14.99,15.88 15.37,16.51 15.37,17.27 15.37,18.03 15.37,18.92 14.73,18.92 13.97,18.92 13.21,18.92 12.45,18.92 11.68,18.92 10.92,19.05 10.29,19.56 9.91,20.32 9.91,21.34 31.11,34.42 31.75,34.42 32.39,34.42 33.02,34.42 33.66,34.42 34.29,34.42 34.93,34.42 35.56,34.42 31.11,39.5 31.75,39.5 32.39,39.5 33.02,39.5 33.66,39.5 34.29,39.5 31.11,38.86 31.75,38.86 32.39,38.86 33.02,38.86 33.66,38.86 34.29,38.86 34.93,38.86 31.11,38.23 31.75,38.23 32.39,38.23 33.02,38.23 33.66,38.23 34.29,38.23 34.93,38.23 35.56,38.23 31.11,37.59 31.75,37.59 32.39,37.59 33.02,37.59 33.66,37.59 34.29,37.59 34.93,37.59 35.56,37.59 31.11,36.96 31.75,36.96 32.39,36.96 33.02,36.96 33.66,36.96 34.29,36.96 34.93,36.96 35.56,36.96 31.11,36.32 31.75,36.32 32.39,36.32 33.02,36.32 33.66,36.32 34.29,36.32 34.93,36.32 35.56,36.32 31.11,35.69 31.75,35.69 32.39,35.69 33.02,35.69 33.66,35.69 34.29,35.69 34.93,35.69 35.56,35.69 31.11,35.05 31.75,35.05 32.39,35.05 33.02,35.05 33.66,35.05 34.29,35.05 34.93,35.05 35.56,35.05 44.45,38.35 57.53,50.8
  pour Top (rank 2, no thermals): 58.8,66.04 58.8,54.23 arc90 65.53,47.62 68.07,47.62 68.07,18.41 65.28,18.41 arc90 58.8,11.81 58.8,0 9.27,0 9.27,11.68 arc90 3.43,18.41 0,18.41 0,47.62 3.05,47.62 arc90 9.14,53.72 9.27,53.72 9.27,66.04
  pour Bottom (no thermals): 9.27,0 9.27,12.19 arc90 3.05,18.41 0,18.41 0,47.62 2.79,47.62 arc90 9.27,54.1 9.27,66.04 58.8,66.04 58.8,53.98 arc90 65.15,47.62 68.07,47.62 68.07,18.41 65.15,18.41 arc90 58.8,12.07 58.8,0
  pour Route2 (no thermals): 9.27,0 9.27,12.19 arc90 3.05,18.41 0,18.41 0,47.62 2.79,47.62 arc90 9.27,54.1 9.27,66.04 58.8,66.04 58.8,53.98 arc90 65.15,47.62 68.07,47.62 68.07,18.41 65.15,18.41 arc90 58.8,12.07 58.8,0
  pour Route15 (no thermals): 9.27,0 9.27,12.19 arc90 3.05,18.41 0,18.41 0,47.62 2.79,47.62 arc90 9.27,54.1 9.27,66.04 58.8,66.04 58.8,53.98 arc90 65.15,47.62 68.07,47.62 68.07,18.41 65.15,18.41 arc90 58.8,12.07 58.8,0
GSM_3V8  (via drill 0.2, 0.61, 0.91)
  Top 0.152: 12.93,53.95 v13.21,53.85
  Top 0.203: R33.2 1.14,30.35
  Top 0.254: R8.2 17.65,20.45 v17.27,20.83 | v1.4,29.08 1.4,28.96
  Top 0.508: R5.1 v13.21,53.85 13.08,53.92 12.93,53.95
  Top 1.016: 1.14,30.35 1.14,42.04 v2.41,43.31
  Bottom 0.254: v17.27,20.83 4.06,20.83 3.56,21.34 3.56,28.57 3.05,29.08 v1.4,29.08
  Bottom 1.778: v2.41,43.31 4.57,43.31 11.18,49.91 11.18,52.32 12.7,53.85 v13.21,53.85
  pour Top (no thermals): 0.89,27.69 0.89,30.73 2.16,30.73 2.16,30.61 2.16,27.69
  pour Top (no thermals): 11.81,54.23 11.81,53.59 12.83,53.59 12.83,54.23
GSM_AUX_RX
  Top 0.203: U11.43 29.11,35.69 25.91,35.69 25.89,35.67 U10.10
GSM_AUX_TX
  Top 0.203: U11.42 29.12,36.2 25.4,36.2 25.39,36.18 U10.11
GSM_CTS  (via drill 0.2)
  Top 0.203: U11.29 31.4,43.27 31.37,43.31 30.61,43.31 29.97,42.67 26.04,42.67 25.65,43.05 24.13,43.05 v23.62,42.55 23.5,42.42 23.5,41.53 23.62,41.4 25.91,41.4 26.29,41.02 TP11.TP | v23.88,32.77 23.88,31.72 U10.14
  Bottom 0.203: v23.62,42.55 23.5,42.42 23.5,33.15 v23.88,32.77
GSM_GATED
  pour Top (no thermals): 6.1,20.32 3.81,20.32 3.81,22.1 0.76,22.1 0.76,25.91 6.1,25.91
GSM_GAUGE_ALERT  (via drill 0.2)
  Top 0.152: U9.5 11.43,52.4 R21.1
  Top 0.203: 11.43,52.4 11.43,52.83 11.68,53.09 13.08,53.09 v13.59,52.58 | v13.59,51.44 13.59,50.8 13.97,50.42 21.84,50.42 22.22,50.8 22.22,55.37 22.86,56.01 39.5,56.01 39.75,55.75 39.75,53.3 U7.11
  Bottom 0.203: v13.59,52.58 v13.59,51.44
GSM_GAUGE_SCL
  Top 0.152: U9.3 10.89,56.8 10.54,57.15 10.54,58.29 10.67,58.42 R22.1
  Top 0.203: 10.54,57.15 10.41,57.15 10.03,56.77 10.03,50.67 11.05,49.66 22.1,49.66 22.99,50.55 22.99,54.99 23.24,55.24 37.47,55.24 37.85,54.86 37.85,52.45 37.97,52.32 38.26,52.32 U7.13
GSM_GAUGE_SDA
  Top 0.152: U9.4 10.93,53.6 10.79,53.47 10.79,51.69 10.93,51.5 R23.1
  Top 0.203: R23.1 11,50.47 11.43,50.04 21.97,50.04 22.61,50.67 22.61,55.12 23.11,55.63 38.35,55.63 38.74,55.24 38.74,53.01 U7.12 38.76,52.96
GSM_GPIO2  (via drill 0.2)
  Top 0.203: U12.P$23 17.02,46.41 v17.02,48.26 | U11.30 30.9,42.63 v30.86,42.67 | v31.37,44.32 30.61,44.32 29.72,43.43 27.05,43.43 26.92,43.56 26.92,44.45 26.54,44.83 24.13,44.83 23.88,45.09 23.88,48.51 23.62,48.77 v22.61,48.77 TP10.TP
  Bottom 0.203: v17.02,48.26 17.53,48.77 v22.61,48.77 | v30.86,42.67 30.86,43.81 v31.37,44.32
GSM_LED  (via drill 0.2)
  Top 0.203: Q1.G 19.39,18.45 R31.2 19.81,19.23 v19.81,19.81 | v18.03,39.88 18.07,39.92 U12.P$16
  Bottom 0.203: v19.81,19.81 19.94,19.94 19.94,21.72 19.56,22.1 14.1,22.1 13.72,22.48 13.72,39.24 14.35,39.88 v18.03,39.88
GSM_POWER
  Top 0.203: Q3.G 22.44,38.52 22.61,38.35 23.24,38.35 23.5,38.1 23.5,36.83 23.62,36.7 | 23.62,36.7 U11.41 | TP6.TP 23.11,36.2 23.62,36.7
GSM_POWER_GATE  (via drill 0.2)
  Top 0.203: Q5.1 3.24,29.6 R32.2 | R33.1 3.63,30.35 R32.2 | R32.2 3.68,29.84 v4.06,29.46 | v9.78,28.7 15.49,28.7 16,29.21 16,40.89 v15.88,41.02 | U11.22 34.91,42.14 v34.8,42.29 | v33.66,45.47 31.11,45.47 29.46,43.81 27.43,43.81 27.3,43.94 27.3,44.7 26.67,45.21 25.02,45.21 v24.51,45.72
  Bottom 0.203: v4.06,29.46 9.02,29.46 v9.78,28.7 | v15.88,41.02 15.88,49.15 16.38,49.66 22.99,49.66 23.88,48.77 23.88,46.36 v24.51,45.72 | v34.8,42.29 34.93,42.29 35.94,43.31 35.94,44.07 35.69,44.32 33.91,44.32 33.91,45.21 v33.66,45.47
GSM_RTS  (via drill 0.2)
  Top 0.203: U10.16 21.86,30.85 v21.59,31.12 | U11.26 32.91,43.55 32.77,43.69 30.48,43.69 29.85,43.05 26.16,43.05 25.78,43.43 24.51,43.43 24.26,43.69 v23.88,43.69 23.11,42.93 23.11,40.64 23.24,40.51 TP12.TP
  Bottom 0.203: v21.59,31.12 21.59,39.62 23.11,41.15 23.11,42.93 v23.88,43.69
GSM_RX  (via drill 0.2)
  Top 0.203: U11.32 29.57,41.91 27.43,41.91 | 27.43,41.91 v25.15,41.91 | v24.89,32.64 v24.89,32.63 U10.12 | TP8.TP 26.29,39.37 27.3,40.39 27.3,41.78 27.43,41.91
  Bottom 0.203: v25.15,41.91 24.77,41.53 24.77,38.86 25.27,38.35 25.27,33.15 24.89,32.77 v24.89,32.64
GSM_TX  (via drill 0.2)
  Top 0.203: U11.31 30.4,42.11 30.23,42.29 25.91,42.29 25.78,42.42 v24.38,42.42 | U10.13 24.39,33.02 v24.38,33.15 TP9.TP
  Bottom 0.203: v24.38,42.42 24.38,38.61 24.89,38.1 24.89,33.91 24.38,33.4 v24.38,33.15
IM880_3V3  (via drill 0.2, 0.61)
  Top 0.152: U4.6 45.31,53.75 45.47,53.59 47.88,53.59 48.01,53.47 48.01,52.5 R6.1
  Top 0.203: R36.2 20.95,1.14 v21.97,2.16 | R9.2 50.17,16.38 v49.78,16
  Top 0.508: Q7.2 21.14,2.99 v21.97,2.16
  Top 0.61: R6.1 v46.86,52.7
  Bottom 0.394: v49.78,16 49.53,16 48.58,16.95
  Bottom 1.016: 47.12,52.45 v46.86,52.7
  Bottom 1.778: 47.12,52.45 48.77,52.45 52.07,49.15 55.88,49.15 65.02,40.01 65.02,25.15 57.53,17.65 49.28,17.65 48.58,16.95 42.55,10.92 42.55,4.19 40.51,2.16 v21.97,2.16
IM880_BOOT  (via drill 0.2)
  Top 0.203: v29.59,31.62 29.9,31.94 U11.49 | v29.59,10.29 29.97,9.91 v34.67,9.91 | U6.26 35.07,4.56 v35.05,4.57
  Bottom 0.203: v29.59,10.29 v29.59,31.62 | v35.05,4.57 35.05,9.52 v34.67,9.91
IM880_CS  (via drill 0.2)
  Top 0.203: U6.15 24.07,16.7 26.42,19.05 34.42,19.05 v35.05,19.69 | v35.31,31.12 35.41,31.27 U11.60
  Bottom 0.203: v35.05,19.69 35.31,19.94 v35.31,31.12
IM880_GATED  (via drill 0.2)
  Top 0.203: U6.17 26.07,10.7 27.05,11.68 40.89,11.68 v41.4,12.19 | v44.83,19.56 44.83,20.07 51.18,20.07 J2.1
  Bottom 0.203: v41.4,12.19 41.4,17.65 41.78,18.03 44.58,18.03 44.83,18.29 v44.83,19.56
  pour Top (no thermals): 20.95,5.84 19.18,5.84 19.18,11.18 24.26,11.18 24.26,10.03 24.13,9.91 21.84,9.91 21.84,5.84
IM880_GAUGE_ALERT  (via drill 0.2)
  Top 0.152: U4.5 44.58,54.61 44.14,54.61 R18.1
  Top 0.203: U7.7 43.42,51.8 v43.43,51.82 | v44.83,52.58 44.7,52.7 44.7,54.48 44.58,54.61
  Bottom 0.203: v43.43,51.82 44.07,51.82 v44.83,52.58
IM880_GAUGE_SCL
  Top 0.152: U4.3 49.78,55.12 49.78,54.74 R19.1
  Top 0.203: U7.9 42.24,55.32 42.67,55.75 48.01,55.75 48.13,55.63 48.13,55.14 U4.3
IM880_GAUGE_SDA
  Top 0.152: R20.1 45.24,55.17 U4.4
  Top 0.203: U7.8 42.78,52.3 42.93,52.45 42.93,53.47 42.67,53.72 42.67,54.99 42.8,55.12 43.26,55.12 R20.1
IM880_INT1  (via drill 0.2)
  Top 0.203: U6.8 33.07,23.04 34.04,24 v36.83,24 | v41.4,40.26 38.23,40.26 U11.15
  Bottom 0.203: v36.83,24 36.96,24.13 36.96,24.89 37.85,25.78 37.85,33.02 38.23,33.4 41.02,33.4 41.4,33.78 v41.4,40.26
IM880_INT2  (via drill 0.2)
  Top 0.203: U6.9 31.07,23.57 31.24,23.75 33.02,23.75 33.78,24.51 v37.59,24.51 | v42.04,40.77 38.24,40.77 U11.16
  Bottom 0.203: v37.59,24.51 38.35,25.27 38.35,32.64 38.61,32.89 41.02,32.89 41.78,33.66 41.78,39.62 42.04,39.88 v42.04,40.77
IM880_NETWORK  (via drill 0.2)
  Top 0.203: 57.31,16.17 R30.2 | Q4.G 57.31,16.17 | 57.31,16.17 57.82,16.17 58.17,16.51 58.17,17.53 v39.88,17.53 | v41.02,20.83 41.02,22.35 U6.4
  Bottom 0.203: v39.88,17.53 39.88,20.45 40.26,20.83 v41.02,20.83
IM880_POWER_GATE  (via drill 0.2)
  Top 0.203: R36.1 19.48,1.17 R37.2 19.24,2.4 Q7.1 18.78,3.83 18.16,4.45 18.16,7.24 18.41,7.49 18.41,12.57 18.8,12.95 v40.51,12.95 | U11.21 35.41,41.94 35.31,42.04 35.31,42.93 35.56,43.18 46.74,43.18 v46.86,43.05
  Bottom 0.203: v40.51,12.95 40.51,19.3 41.66,20.45 44.96,20.45 45.34,20.83 45.34,31.88 46.1,32.64 46.1,38.61 47.37,39.88 47.37,42.55 v46.86,43.05
IM880_RX  (via drill 0.2)
  Top 0.203: v30.86,30.35 30.9,30.44 U11.51 | U6.18 30.8,8.7 v30.99,8.89
  Bottom 0.203: v30.86,30.35 30.35,29.84 30.35,11.3 30.99,10.67 v30.99,8.89
IM880_SWCLK
  Top 0.203: U6.2 45.07,23.61 45.34,23.88 52.32,23.88 52.96,23.24 J2.4
IM880_SWDIO
  Top 0.203: U6.3 43.07,21.32 43.43,20.96 48.39,20.96 49.02,21.59 49.02,22.23 49.28,22.48 51.05,22.48 J2.2
IM880_TX  (via drill 0.2)
  Top 0.203: v30.23,30.99 30.4,31.17 U11.50 | U6.19 29.81,6.7 v30.23,7.11
  Bottom 0.203: v30.23,7.11 30.23,10.8 29.97,11.05 29.97,30.35 30.23,30.61 v30.23,30.99
MISO  (via drill 0.2)
  Top 0.203: 32.89,32.42 U11.55 32.91,31.76 32.51,31.37 32.51,28.96 32.77,28.7 v32.77,28.32 33.02,28.07 42.04,28.07 42.42,28.45 42.93,28.45 43.31,28.07 47.75,28.07 v48.01,28.32 | U6.12 25.07,23.8 25.53,24.26 32.51,24.26 v32.77,24.51 | U1.14 48.78,38.6 v48.64,38.61
  Bottom 0.203: v32.77,24.51 v32.77,28.32 | v48.64,38.61 48.64,32.26 48.01,31.62 v48.01,28.32
MOD_IN  (via drill 0.2)
  Top 0.203: U11.20 35.91,42.33 v35.81,42.42 36.2,42.8 40.01,42.8 40.13,42.67 TP3.TP | J1.10 31.5,57.02 31.62,56.9 35.69,56.9 v35.94,56.64
  Bottom 0.203: v35.81,42.42 36.32,42.93 36.32,44.32 35.94,44.7 35.81,44.7 35.69,44.83 35.69,47.75 35.94,48.01 36.2,48.01 36.32,48.13 36.32,56.26 v35.94,56.64
MOD_OUT  (via drill 0.2)
  Top 0.203: v35.05,46.99 35.81,46.99 36.83,45.97 v40.64,45.97 | U11.14 40.56,39.71 v40.64,39.75 42.29,39.75 42.55,40.01 42.55,41.02 41.66,41.91 TP1.TP
  Bottom 0.203: J1.8 34.04,57.28 35.94,55.37 35.94,48.64 35.18,47.88 35.18,47.12 v35.05,46.99 | v40.64,39.75 v40.64,45.97
MOSI  (via drill 0.2)
  Top 0.203: U6.13 32.01,20.7 v32.13,20.7 | U11.56 33.41,31.75 32.89,31.24 32.89,29.34 v33.28,28.96 33.4,28.83 33.78,28.45 41.91,28.45 42.29,28.83 43.05,28.83 43.43,28.45 46.99,28.45 v47.24,28.83 | U1.15 48.27,37.6 v48.01,37.59
  Bottom 0.203: v32.13,20.7 33.4,21.84 33.4,25.27 33.41,25.28 33.41,28.83 v33.28,28.96 | v48.01,37.59 48.01,37.34 48.26,37.08 48.26,32.51 47.24,31.37 v47.24,28.83
N$1  (via drill 0.2)
  Top 0.203: U12.P$41 5.58,36.58 v4.06,36.58 4.06,35.94 3.89,35.76 3.18,35.76 D1.CATHODE C7.1
  Bottom 0.203: J4.C1 9.91,29.97 9.4,30.48 9.4,37.08 9.02,37.47 4.95,37.47 v4.06,36.58
N$2  (via drill 0.2)
  Top 0.203: C6.1 D3.CATHODE 3.35,37.72 v4.06,37.72 U12.P$40
  Bottom 0.203: J4.C2 10.16,32.51 9.78,32.89 9.78,37.72 9.4,38.1 4.57,38.1 4.19,37.72 v4.06,37.72
N$3  (via drill 0.2)
  Top 0.203: C5.1 D2.CATHODE 3.81,38.35 4.19,38.73 5.54,38.73 | v7.49,39.75 7.49,38.99 7.24,38.73 5.54,38.73 | 5.54,38.73 U12.P$39
  Bottom 0.203: J4.C7 10.79,35.05 10.54,35.31 10.54,39.12 9.91,39.75 v7.49,39.75
N$4  (via drill 0.2)
  Top 0.203: D4.CATHODE C4.1 3.81,40.13 v4.06,39.88 5.58,39.88 U12.P$38
  Bottom 0.203: J4.C3 10.41,33.78 10.16,34.04 10.16,38.61 9.78,38.99 4.95,38.99 v4.06,39.88
N$5
  Top 0.203: U10.8 27.85,29.35 R10.1
N$6
  Top 0.394: U12.P$56 9.27,20.19 arc90 11.3,18.16 14.24,18.16 arc-90 C3.1
N$7
  Top 0.394: C3.2 P1.1
N$8
  Top 0.203: R8.1 17.65,15.89 LED1.A
N$9  (via drill 0.2)
  Top 0.203: U11.53 31.9,32.03 31.75,31.88 31.75,27.43 31.88,27.3 42.55,27.3 v42.67,27.43 | v36.7,46.86 37.21,46.36 38.1,46.36 38.23,46.48 43.43,46.48 v43.82,46.1 42.67,44.96 TP13.TP | v37.34,51.18 37.39,51.13 37.39,51.08 38.16,50.3 U7.17 38.77,50.29 R14.2
  Bottom 0.203: v37.34,51.18 37.08,50.93 37.08,47.37 v36.7,46.86 | v43.82,46.1 45.34,44.58 45.34,42.67 46.23,41.78 46.23,40.64 44.96,39.37 44.96,33.4 43.82,32.26 43.82,30.73 42.67,29.59 v42.67,27.43
N$10  (via drill 0.2)
  Top 0.203: U10.4 24.39,27.82 24.13,27.56 24.13,26.92 v24.26,26.8 | v22.1,35.43 19.61,35.43 U12.P$12
  Bottom 0.203: v24.26,26.8 24.13,26.92 24.13,30.61 22.61,32.13 22.61,35.31 22.48,35.43 v22.1,35.43
N$11  (via drill 0.2)
  Top 0.203: U10.5 24.89,27.43 v24.77,27.3 | v22.1,36.58 19.56,36.58 U12.P$13
  Bottom 0.203: v24.77,27.3 24.77,31.37 24.64,31.5 23.88,31.5 23.11,32.26 23.11,36.45 22.99,36.58 v22.1,36.58
N$12
  Top 0.203: R24.2 37.21,51.94 37.35,51.8 U7.14
N$13
  Top 0.203: LED1.C 19.16,16.78 Q1.D
N$14
  Top 0.203: U12.P$18 21.07,42.12 Q2.D
N$15  (via drill 0.2)
  Top 0.203: U12.P$2 C20.1 21.21,24.56 v21.21,25.53 | v21.21,40.89 21.72,40.89 22.02,40.59 R25.2
  Bottom 0.203: v21.21,25.53 14.22,25.53 14.1,25.65 14.1,38.86 14.35,39.12 19.18,39.12 21.08,40.89 v21.21,40.89
N$16
  Top 0.203: U12.P$15 21.03,38.82 Q3.D 21.11,39.71 R25.1
N$17  (via drill 0.2)
  Top 0.203: R3.1 45.21,42.04 v45.47,41.78 | v43.18,37.85 42.8,38.23 38.2,38.23 U11.11
  Bottom 0.203: v45.47,41.78 45.85,41.4 45.85,40.77 43.94,38.86 43.94,37.85 v43.18,37.85
N$18  (via drill 0.2)
  Top 0.203: R4.1 44.63,40.56 v44.58,40.51 | v43.31,38.61 38.28,38.61 U11.12
  Bottom 0.203: v44.58,40.51 44.58,40.13 43.31,38.86 v43.31,38.61
N$19
  Top 0.508: Q6.3 59.52,44.25 U1.1
N$20  (via drill 0.2)
  Top 0.203: U12.P$29 10.37,48.85 10.79,49.28 19.68,49.28 JP1.2 | U10.6 25.39,26.94 v25.4,26.92
  Bottom 0.203: v25.4,26.92 25.4,29.21 25.65,29.46 25.65,38.61 25.27,38.99 25.27,41.27 25.65,41.66 25.65,44.2 23.75,44.2 23.5,44.45 23.5,45.47 JP1.2
N$21  (via drill 0.2)
  Top 0.203: U12.P$28 11.47,48.56 11.81,48.9 19.43,48.9 20.83,47.5 20.83,45.59 JP1.1 v26.16,44.2 | U10.7 25.89,27.58 v26.04,27.43
  Bottom 0.203: v26.04,27.43 26.04,38.73 25.65,39.12 25.65,41.15 26.04,41.53 26.04,43.94 v26.16,44.2
N$22  (via drill 0.2)
  Top 0.203: U10.3 23.89,27.82 v23.5,27.43 | v22.1,34.42 U12.P$11
  Bottom 0.203: v23.5,27.43 23.5,30.61 22.1,32 v22.1,34.42
N$23
  Top 0.203: U12.P$10 19.57,33.27 20.7,33.27 20.95,33.02 20.95,29.46 21.07,29.35 U10.1
N$24
  Top 0.102: U6.31 45.07,3.29
  Top 0.394: 45.07,3.29 45.07,8.24 45.09,8.76 arc-90 48.64,11.81 P2.1
N$25  (via drill 0.2)
  Top 0.203: U6.23 29.07,4.68 29.46,5.08 v38.23,5.08 | v41.02,23.75 41.02,24.31 R1.1
  Bottom 0.203: v38.23,5.08 38.74,5.08 39.37,5.72 39.37,23.62 39.5,23.75 v41.02,23.75
N$26  (via drill 0.2)
  Top 0.203: U6.21 25.07,5.26 25.53,5.72 v37.34,5.72 | v38.48,24.13 39.06,24.13 R2.1
  Bottom 0.203: v38.48,24.13 38.48,6.6 37.59,5.72 v37.34,5.72
N$27
  Top 0.203: LED2.A R9.1
N$28
  Top 0.203: Q4.D LED2.C
N$33
  Top 0.203: U11.25 33.48,41.55 C15.1 FB4.1
N$34
  Top 0.254: C9.2 U2.9
N$36
  Top 0.254: R28.1 55.63,51.56 55.5,51.69 55.2,51.69 U2.4
N$37
  Top 0.254: U2.5 56.48,52.72 R40.1 R39.2
N$38
  Top 0.254: U8.9 20.61,51.71 C10.2
N$40
  Top 0.254: R29.1 17.23,52.83 U8.4
N$41
  Top 0.254: U8.5 18.43,51.9 R41.1 R38.2
N$44
  Top 0.203: U11.7 38.19,36.2 38.74,36.2 38.86,36.07 42.8,36.07 43.43,36.7 44.77,36.7 L3.P$1 45.39,37.32 46.23,37.47 46.23,38.3 C22.1 C19.1
N$52
  Top 0.203: U11.5 38.21,35.18 38.74,35.18 38.99,35.31 39.62,35.31 40.32,34.74 L3.P$2
N$53
  Top 0.203: U11.37 29.1,38.73 28.57,38.73 28.57,39.12 28.61,39.21 U11.36
N$54
  Top 0.203: U11.33 28.77,40.71 28.7,40.64 28.7,40.26 28.75,40.21 U11.34
NUCLEUM_3V3
  Top 0.152: R7.1 48.9,50.38 U5.6
  Top 0.203: R34.2 56.76,46.55 Q6.2
  Top 0.508: 48.9,50.38 49.19,50.38 49.66,49.91 49.66,46.99 50.42,46.23 56.44,46.23 R34.2
NUCLEUM_BOOT  (via drill 0.2)
  Top 0.203: U11.45 29.17,34.71 29.08,34.67 27.18,34.67 v27.05,34.54 | v27.69,25.78 51.35,25.78 U1.24
  Bottom 0.203: v27.05,34.54 26.8,34.29 26.8,28.19 27.3,27.69 27.3,26.16 v27.69,25.78
NUCLEUM_CS  (via drill 0.2)
  Top 0.203: v51.31,31.62 50.04,31.62 U1.19 | U11.54 32.39,32.41 32.39,31.75 32.13,31.5 32.13,27.81 32.26,27.69 42.16,27.69 42.55,28.07 42.8,28.07 43.18,27.69 48.39,27.69 48.51,27.81 48.51,29.08 v48.64,29.21
  Bottom 0.203: v48.64,29.21 48.64,31.5 48.77,31.62 v51.31,31.62
NUCLEUM_GAUGE_ALERT
  Top 0.203: U5.5 48.9,49.28 48.9,47.12 48.77,46.99 R15.1 48.39,46.91 48.39,46.36 48.26,46.23 46.36,46.23 45.97,46.61 45.97,47.75 45.85,47.88 44.2,47.88 43.69,48.39 43.69,50.16 43.55,50.3 U7.4
NUCLEUM_GAUGE_SCL
  Top 0.152: U5.3 44.57,48.78 44.45,48.9 | 45.67,51.18 R16.1
  Top 0.203: 44.45,48.9 44.45,49.78 | 44.45,49.78 44.45,51.05 44.58,51.18 45.67,51.18 | U7.6 43.06,51.3 43.31,51.05 44.45,51.05 44.45,49.78
NUCLEUM_GAUGE_SDA
  Top 0.203: R17.1 48.29,47.78 48.29,48.26 | 48.29,48.26 U5.4 | U7.5 42.67,50.8 42.8,50.67 43.94,50.68 44.07,50.55 44.07,48.64 44.45,48.26 48.29,48.26
NUCLEUM_INT1/RTS  (via drill 0.2, 0.2 pad 0.41)
  Top 0.203: U1.20 49.03,30.6 v46.74,32.89 | v32.64,44.32 35.81,44.32 36.7,43.56 v47.5,43.56 | U11.27 32.39,41.5 v32.39,42.29
  Bottom 0.203: v32.64,44.32 32.64,42.55 v32.39,42.29 | v46.74,32.89 46.99,33.15 46.99,35.43 46.48,35.94 46.48,38.35 47.75,39.62 47.75,43.31 v47.5,43.56
NUCLEUM_INT2/CTS  (via drill 0.2)
  Top 0.203: U1.21 49.27,29.6 48.13,30.73 v45.97,30.73 | v32,44.96 33.15,44.96 33.4,44.7 36.07,44.7 36.83,43.94 46.36,43.94 46.61,44.2 v48.13,44.2 | v32,43.05 31.9,42.9 U11.28
  Bottom 0.203: v45.97,30.73 45.97,31.37 47.37,32.77 47.37,35.69 46.86,36.2 46.86,38.1 48.13,39.37 v48.13,44.2 | v32,44.96 v32,43.05
NUCLEUM_POWER_GATE  (via drill 0.2)
  Top 0.203: U11.48 29.13,33.07 v28.45,32.38 | v29.08,27.69 29.21,27.69 29.97,26.92 48.01,26.92 v48.26,27.18 | v52.71,47.24 56.44,47.24 R34.1
  Top 0.254: R34.1 R35.2 57.41,47.95 Q6.1
  Bottom 0.203: v28.45,32.38 28.32,32.38 27.94,32 27.94,28.96 29.08,27.81 v29.08,27.69 | v48.26,27.18 50.04,27.18 50.29,27.43 50.29,30.48 50.67,30.86 52.2,30.86 52.2,46.74 v52.71,47.24
NUCLEUM_RX  (via drill 0.2)
  Top 0.203: U11.47 28.63,33.71 v28.19,33.27 | v28.7,27.05 29.08,27.05 29.59,26.54 48.64,26.54 48.9,26.8 48.9,28.45 49.02,28.57 49.99,28.57 U1.22
  Bottom 0.203: v28.19,33.27 27.56,32.64 27.56,28.7 28.45,27.81 28.45,27.3 v28.7,27.05
NUCLEUM_TX  (via drill 0.2)
  Top 0.203: U11.46 27.9,34.21 v27.56,33.91 | v28.19,26.42 29.08,26.42 29.34,26.16 49.53,26.16 49.91,26.54 49.91,27.5 U1.23
  Bottom 0.203: v27.56,33.91 27.18,33.53 27.18,28.45 27.81,27.81 27.81,26.8 v28.19,26.42
PPS  (via drill 0.2)
  Top 0.203: J1.7 35.31,60.96 35.31,58.04 36.58,56.77 v36.7,56.77 | U11.19 36.41,41.99 v36.7,42.29 38.35,42.29 TP2.TP
  Bottom 0.203: v36.7,56.77 36.7,47.75 36.58,47.62 36.32,47.62 36.07,47.37 36.07,45.21 36.7,44.58 v36.7,42.29
SCL  (via drill 0.2)
  Top 0.203: R2.2 40.31,25.09 v40.26,25.15 | R4.2 43.05,41.15 42.67,41.53 v42.67,41.66
  Bottom 0.203: J1.5 35.31,60.96 35.31,58.17 36.07,57.4 39.37,57.4 40.77,56.01 40.77,46.74 42.67,46.74 v42.67,41.66 42.67,39.5 42.16,38.99 42.16,33.53 41.15,32.51 38.86,32.51 38.74,32.38 38.74,26.16 38.99,25.91 40.01,25.91 40.26,25.65 v40.26,25.15
SCL_INTERNAL  (via drill 0.2)
  Top 0.203: U11.58 34.41,31.74 33.66,30.99 33.66,29.97 34.42,29.21 37.72,29.21 38.1,29.59 v43.82,29.59 | 37.64,48.95 v37.59,48.9 37.72,49.02 37.72,49.53 | v37.59,46.86 42.8,46.86 42.93,46.99 43.94,46.99 v44.2,46.74 44.58,46.36 44.58,45.21 TP5.TP | R13.2 37.72,49.53 | 37.72,49.53 37.97,49.78 38.76,49.78 U7.18
  Bottom 0.203: v37.59,48.9 v37.59,46.86 | v44.2,46.74 45.72,45.21 45.72,42.8 46.61,41.91 46.61,40.39 45.34,39.12 45.34,33.15 44.32,32.13 44.32,30.1 v43.82,29.59
SCLK  (via drill 0.2)
  Top 0.203: U6.14 24.92,18.7 26.16,19.94 v33.91,19.94 | U11.59 34.91,31.64 v34.54,30.99 34.54,30.1 35.18,29.59 37.47,29.59 37.72,29.84 37.72,30.48 44.96,30.48 45.34,30.1 v46.48,30.1 | U1.16 47.52,36.6 v47.5,36.58
  Bottom 0.203: v33.91,19.94 34.54,20.57 v34.54,30.99 | v47.5,36.58 47.88,36.2 47.88,32.64 46.74,31.5 46.74,30.35 v46.48,30.1
SDA  (via drill 0.2)
  Top 0.203: R1.2 42.09,25.09 v42.04,25.15 | R3.2 43.76,42.6 v43.69,42.67
  Bottom 0.203: J1.6 36.58,58.55 36.96,58.17 39.5,58.17 41.4,56.26 41.4,47.12 43.05,47.12 43.18,46.99 43.18,42.55 | v42.04,25.15 42.04,26.29 39.24,26.29 39.12,26.42 39.12,32 39.24,32.13 41.4,32.13 42.55,33.27 42.55,38.61 43.18,39.24 43.18,42.55 | v43.69,42.67 43.31,42.67 43.18,42.55
SDA_INTERNAL  (via drill 0.2)
  Top 0.203: U11.57 33.91,31.75 33.27,31.12 33.27,29.72 34.16,28.83 41.78,28.83 42.16,29.21 43.18,29.21 43.56,28.83 44.45,28.83 v44.7,29.08 | U7.19 38.74,49.26 38.74,48.26 38.61,48.14 38.53,48.14 R12.2 38.03,47.32 38.1,47.24 42.55,47.24 42.67,47.37 v44.45,47.37 46.1,45.72 TP4.TP
  Bottom 0.203: v44.45,47.37 46.1,45.72 46.1,42.93 46.99,42.04 46.99,40.13 45.72,38.86 45.72,32.89 44.83,32 44.83,29.21 v44.7,29.08
USB_D+  (via drill 0.2)
  Top 0.203: U11.63 36.91,31.8 v37.08,31.62
  Bottom 0.203: v37.08,31.62 37.08,38.23 35.94,39.37 35.94,40.77 35.81,40.89 30.1,40.89 29.97,40.77 29.97,39.37 29.21,38.61 27.18,38.61 26.42,39.37 26.42,40.89 26.8,41.27 26.8,43.56 27.18,43.81 27.18,45.97 26.67,46.48 25.4,46.48 24.64,47.24 24.64,49.15 24.38,49.4 24.38,57.4 24.51,57.53 29.34,57.53 29.46,57.66 29.46,58.55 30.23,59.31 30.23,60.96 J1.11
USB_D-  (via drill 0.2)
  Top 0.203: U11.62 36.41,32.3 36.45,32.13 v36.45,30.99
  Bottom 0.203: v36.45,30.99 36.45,38.23 35.31,39.37 35.31,40.26 35.05,40.51 30.61,40.51 30.35,40.26 30.35,39.24 29.34,38.23 26.54,38.23 26.42,38.35 26.42,38.86 26.04,39.24 26.04,41.02 26.42,41.4 26.42,43.69 26.67,43.94 26.67,45.85 26.42,46.1 25.15,46.1 24.26,46.99 24.26,49.02 24,49.28 24,57.91 24.26,58.17 28.7,58.17 28.96,58.42 J1.12
V_GSM_INT
  Top 0.203: U12.P$4 21.64,26.72 21.97,27.05 | 21.97,27.05 21.97,28.19 22.22,28.45 23.35,28.45 U10.2 | R10.2 27.94,27.81 26.29,26.16 22.1,26.16 21.97,26.29 21.97,27.05

## Text on the board
tNames: GND | 5V | 3V8 | 3V3 | GSM / GPIO2 | Aux / UART | TX | INT | SCL | SDA | RX | IN | OUT | SMBUS | PPS | RTS | CTS | GSM | RST | RX | PWR | GSM | TX | Signpost Radio Module | 09/2016 | Rev_A | Joshua Adkins